# EasyEDA schematic SCH_USB2MULTIRS_2022-08-20.json
TITLE: USB para multi-serial; REV: 1.0; Date: 2021-02-12; Sheet: 1/1; Drawn By: MARCODEOLI; Company: MARCOADEOLI@outlook.com
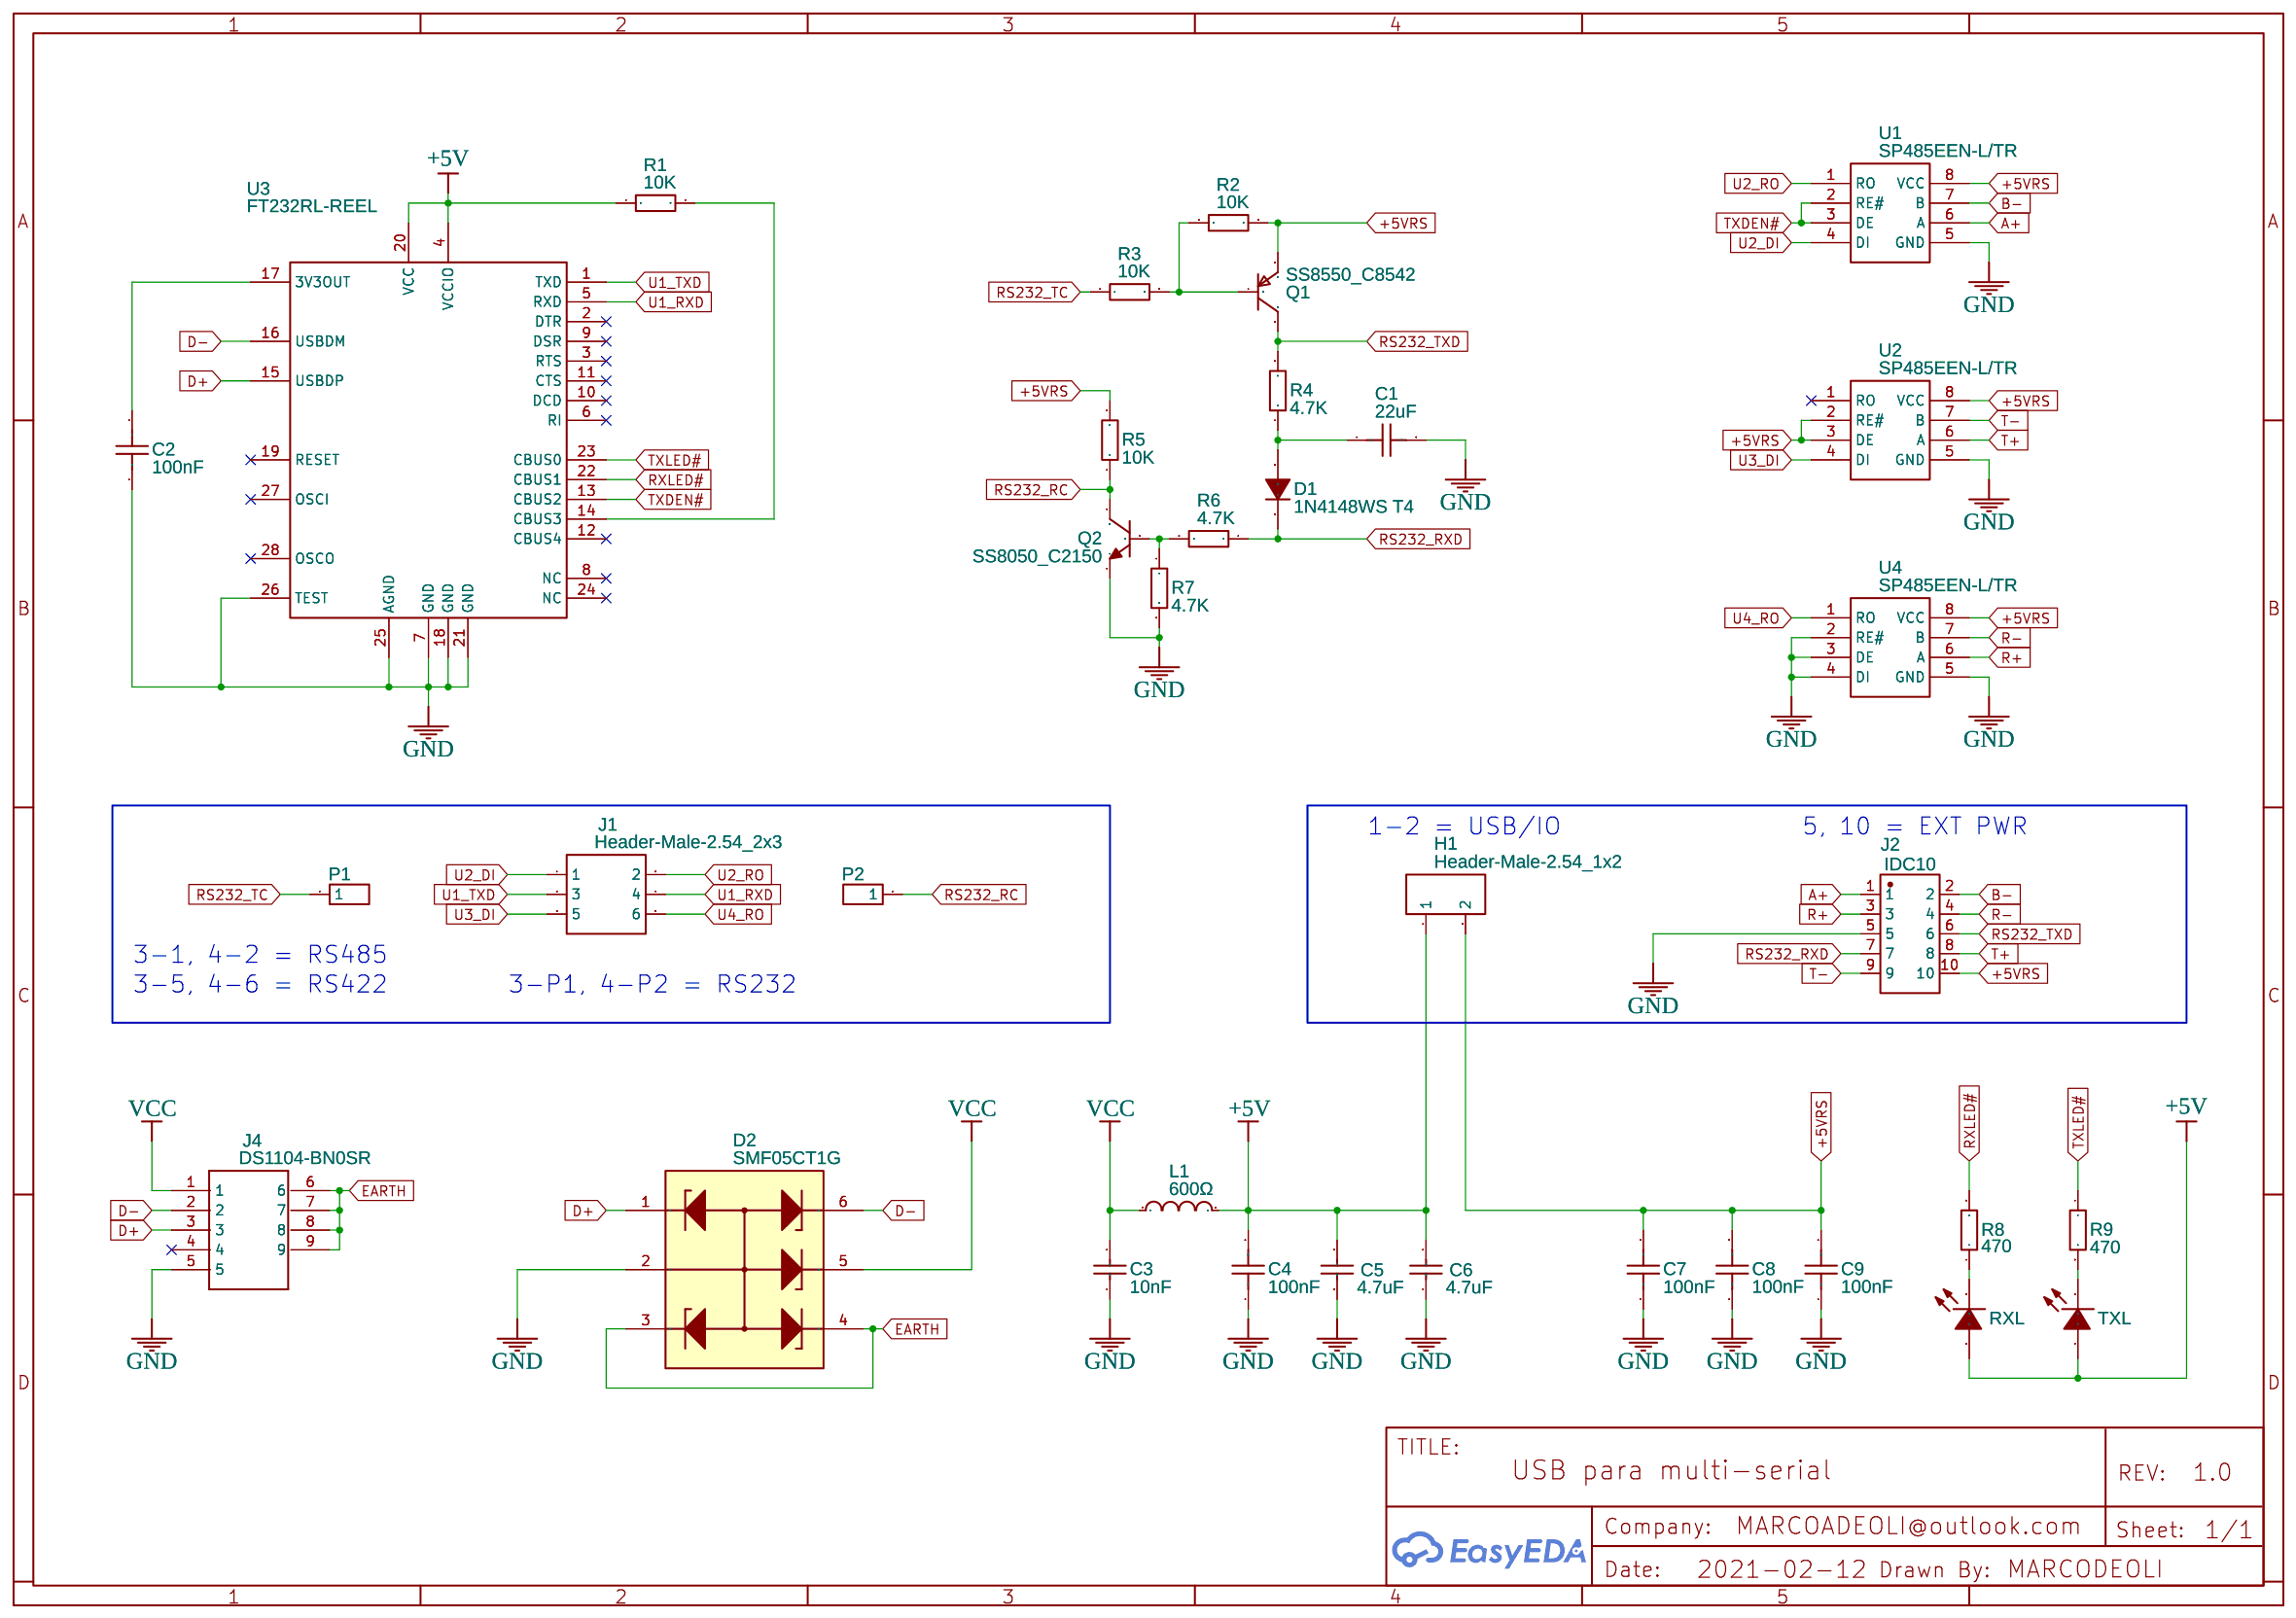
[diagram p0: schematic sheet]

## Parts
C1  22uF  [C0805]
C2  100nF  [C0603]
C3  10nF  [C0603]
C4  100nF  [C0603]
C5  4.7uF  [C0603]
C6  4.7uF  [C0603]
C7  100nF  [C0603]
C8  100nF  [C0603]
C9  100nF  [C0603]
D1  1N4148WS T4  [SOD-323_L1.8-W1.3-LS2.5-RD]
D2  SMF05CT1G  [SOT-363_L2.0-W1.3-P0.65-LS2.1-TL]
H1  Header-Male-2.54_1x2  [HDR-TH_2P-P2.54-V]
J1  Header-Male-2.54_2x3  [HDR-TH_6P-P2.54-V-R2-C3-S2.54]
J2  IDC10  [IDC-TH_10P-P2.54-V-R2-C5-S2.54]
J4  DS1104-BN0SR  [DS1104BN0SR]
L1  600Ω  [L0805]
P1  Header-Male-2.54_1x1  [HDR-TH_1P-P2.54-V-M]
P2  Header-Male-2.54_1x1  [HDR-TH_1P-P2.54-V-M]
Q1  SS8550_C8542  [SOT-23-3_L2.9-W1.3-P1.90-LS2.4-BR]
Q2  SS8050_C2150  [SOT-23-3_L2.9-W1.3-P1.90-LS2.4-BR]
R1  10K  [R0603]
R2  10K  [R0603]
R3  10K  [R0603]
R4  4.7K  [R0603]
R5  10K  [R0603]
R6  4.7K  [R0603]
R7  4.7K  [R0603]
R8  470  [R0603]
R9  470  [R0603]
RXL  RXL  [LED0603-R-RD]
TXL  TXL  [LED0603-R-RD]
U1  SP485EEN-L/TR  [SOIC-8_L5.0-W4.0-P1.27-LS6.0-BL]
U2  SP485EEN-L/TR  [SOIC-8_L5.0-W4.0-P1.27-LS6.0-BL]
U3  FT232RL-REEL  [SSOP-28_L10.2-W5.3-P0.65-LS7.8-BL]
U4  SP485EEN-L/TR  [SOIC-8_L5.0-W4.0-P1.27-LS6.0-BL]

## Library data of the parts
C1 = CL21A226MAQNNNE: Supplier: LCSC; Manufacturer: SAMSUNG; Supplier Part: C45783; SMT Type: Basic; JLCPCB SMD: Yes; LCSC Assembly: Yes
C2 C4 C7-C9 = CC0603KRX7R9BB104: Supplier: LCSC; Manufacturer: YAGEO; Supplier Part: C14663; SMT Type: Basic; JLCPCB SMD: Yes; LCSC Assembly: Yes
C3 = 0603B103K500NT: Supplier: LCSC; Manufacturer: FH; Supplier Part: C57112; SMT Type: Basic; JLCPCB SMD: Yes; LCSC Assembly: Yes
C5 C6 = CL10A475KO8NNNC: Supplier: LCSC; Manufacturer: SAMSUNG; Supplier Part: C19666; SMT Type: Basic; JLCPCB SMD: Yes; LCSC Assembly: Yes
D1 = 1N4148WS T4: Supplier: LCSC; Manufacturer: CJ; image: //image.lceda.cn/szlcsc/C2128.jpg; Supplier Part: C2128; SMT Type: Basic; JLCPCB SMD: Yes; LCSC Assembly: Yes
D2 = SMF05CT1G: Supplier: LCSC; Manufacturer: ON; image: //image.lceda.cn/szlcsc/C15879.jpg; Supplier Part: C15879; SMT Type: Basic; JLCPCB SMD: Yes; LCSC Assembly: Yes
H1 = Header-Male-2.54_1x2: Supplier: LCSC; Manufacturer: TE Connectivity; Manufacturer Part: 826629-2; image: //image.lceda.cn/szlcsc/C86471.jpg; Supplier Part: C86471; LCSC Assembly: Yes; SMT Type: Extend; Package Display: No
J1 = Header-Male-2.54_2x3: Supplier: LCSC; Manufacturer: BOOMELE; Supplier Part: C65114; LCSC Assembly: Yes; SMT Type: Extend; Package Display: No
J2 = IDC10: Contributor: romanlee; Package Display: No
J4 = DS1104-BN0SR: Contributor: kutsiarda; Package Display: No
L1 = GZ2012D601TF: Supplier: LCSC; Manufacturer: Sunlord; Supplier Part: C1017; SMT Type: Basic; JLCPCB SMD: Yes; LCSC Assembly: Yes
P1 P2 = Header-Male-2.54_1x1: Supplier: LCSC; Manufacturer: ReliaPro; Supplier Part: C81276; LCSC Assembly: Yes; SMT Type: Extend; Package Display: No
Q1 = SS8550_C8542: Supplier: LCSC; Manufacturer: CJ; Manufacturer Part: SS8550; image: //image.lceda.cn/szlcsc/C8542.jpg; Supplier Part: C8542; SMT Type: Basic; JLCPCB SMD: Yes; LCSC Assembly: Yes
Q2 = SS8050_C2150: Supplier: LCSC; Manufacturer: CJ; Manufacturer Part: SS8050; image: //image.lceda.cn/szlcsc/C2150.jpg; Supplier Part: C2150; SMT Type: Basic; JLCPCB SMD: Yes; LCSC Assembly: Yes
R1-R3 R5 = 0603WAF1002T5E: Supplier: LCSC; Manufacturer: UniOhm; Supplier Part: C25804; SMT Type: Basic; JLCPCB SMD: Yes; LCSC Assembly: Yes
R4 R6 R7 = 0603WAF4701T5E: Supplier: LCSC; Manufacturer: UniOhm; Supplier Part: C23162; SMT Type: Basic; JLCPCB SMD: Yes; LCSC Assembly: Yes
R8 R9 = 0603WAF4700T5E: Supplier: LCSC; Manufacturer: UniOhm; Supplier Part: C23179; SMT Type: Basic; JLCPCB SMD: Yes; LCSC Assembly: Yes
RXL = 0603White light_C2290: Supplier: LCSC; Manufacturer: KENTO; Manufacturer Part: 0603White light; image: //image.lceda.cn/szlcsc/C2290.jpg; Supplier Part: C2290; SMT Type: Basic; JLCPCB SMD: Yes; LCSC Assembly: Yes; Package Display: No
TXL = KT-0603R: Supplier: LCSC; Manufacturer: KENTO; image: //image.lceda.cn/szlcsc/C2286.jpg; Supplier Part: C2286; SMT Type: Basic; JLCPCB SMD: Yes; LCSC Assembly: Yes; Package Display: No
U1 U2 U4 = SP485EEN-L/TR: Supplier: LCSC; Manufacturer: EXAR; Supplier Part: C6855; SMT Type: Basic; JLCPCB SMD: Yes; LCSC Assembly: Yes
U3 = FT232RL-REEL: Supplier: LCSC; Manufacturer: FTDI; image: //image.lceda.cn/szlcsc/C8690.jpg; Supplier Part: C8690; SMT Type: Basic; JLCPCB SMD: Yes; LCSC Assembly: Yes

## Nets
+5V: C4.2 C5.2 C6.2 H1.1 L1.2 R1.1 RXL.1(A) TXL.1(A) U3.4(VCCIO) U3.20(VCC)
+5VRS: C7.2 C8.2 C9.2 H1.2 J2.10 Q1.2(E) R2.2 R5.2 U1.8(VCC) U2.2(RE#) U2.3(DE) U2.8(VCC) U4.8(VCC)
GND: C1.2 C2.1 C3.1 C4.1 C5.1 C6.1 C7.1 C8.1 C9.1 D2.2 J2.5 J4.5 Q2.2(E) R7.2 U1.5(GND) U2.5(GND) U3.7(GND) U3.18(GND) U3.21(GND) U3.25(AGND) U3.26(TEST) U4.2(RE#) U4.3(DE) U4.4(DI) U4.5(GND)
VCC: C3.2 D2.5 J4.1 L1.1
A+: J2.1 U1.6(A)
B-: J2.2 U1.7(B)
D+: D2.1 J4.3 U3.15(USBDP)
D-: D2.6 J4.2 U3.16(USBDM)
EARTH: D2.3 D2.4 J4.6 J4.7 J4.8 J4.9
R+: J2.3 U4.6(A)
R-: J2.4 U4.7(B)
RS232_RC: P2.1 Q2.3(C) R5.1
RS232_RXD: D1.1(K) J2.7 R6.1
RS232_TC: P1.1 R3.1
RS232_TXD: J2.6 Q1.3(C) R4.2
RXLED#: R8.2 U3.22(CBUS1)
T+: J2.8 U2.6(A)
T-: J2.9 U2.7(B)
TXDEN#: U1.2(RE#) U1.3(DE) U3.13(CBUS2)
TXLED#: R9.1 U3.23(CBUS0)
U1_RXD: J1.4 U3.5(RXD)
U1_TXD: J1.3 U3.1(TXD)
U2_DI: J1.1 U1.4(DI)
U2_RO: J1.2 U1.1(RO)
U3_DI: J1.5 U2.4(DI)
U4_RO: J1.6 U4.1(RO)
Net-(C1-1): C1.1 D1.2(A) R4.1
Net-(C2-2): C2.2 U3.17(3V3OUT)
Net-(Q1-1): Q1.1(B) R2.1 R3.2
Net-(Q2-1): Q2.1(B) R6.2 R7.1
Net-(R1-2): R1.2 U3.14(CBUS3)
Net-(R8-1): R8.1 RXL.2(K)
Net-(R9-2): R9.2 TXL.2(K)

Not connected (* = marked no-connect by the designer): J4 4*; U2 1(RO)*; U3 2(DTR)* 3(RTS)* 6(RI)* 8(NC)* 9(DSR)* 10(DCD)* 11(CTS)* 12(CBUS4)* 19(RESET)* 24(NC)* 27(OSCI)* 28(OSCO)*

## Notes on the sheet
- 1-2 = USB/IO
- 5, 10 = EXT PWR
- 3-1, 4-2 = RS485
- 3-5, 4-6 = RS422
- 3-P1, 4-P2 = RS232
